# Altium schematic sheet Aixcel_Tiny_Recon_Board.SchDoc
size A4; Organization: Altium Limited; Address1: L3, 12a Rodborough Rd; Address2: Frenchs Forest; Address3: NSW; Address4: Australia 2086; DocumentNumber: 01; Revision: 01; SheetNumber: 1; SheetTotal: 4
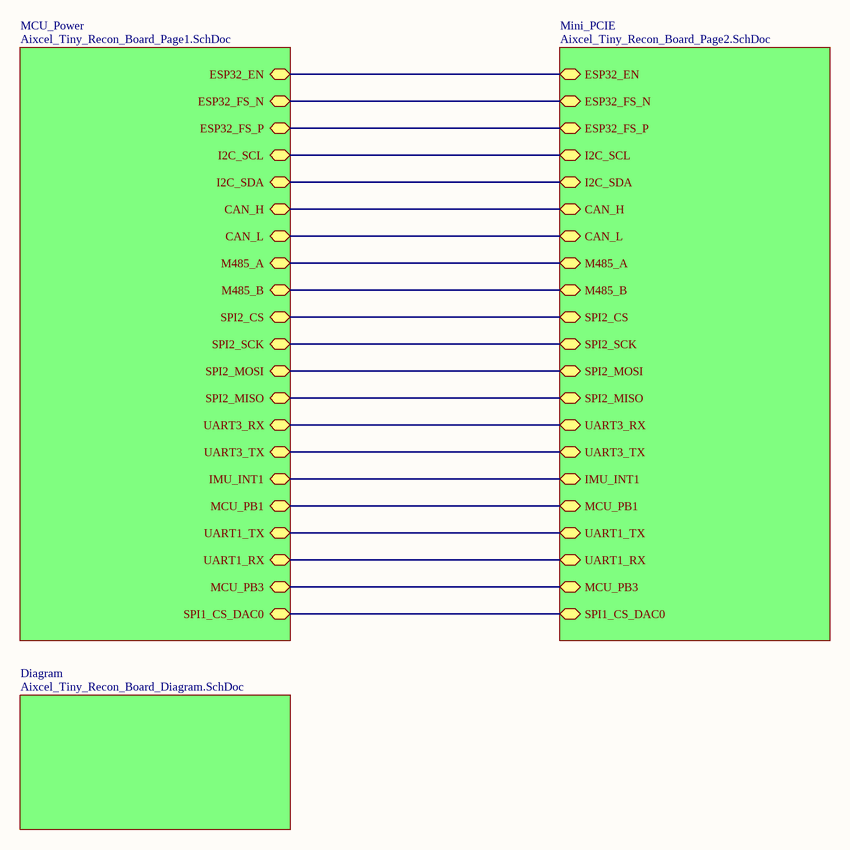
[diagram p0: Aixcel_Tiny_Recon_Board.SchDoc]

## Sub-sheets
Diagram = Aixcel_Tiny_Recon_Board_Diagram.SchDoc: no entries
MCU_Power = Aixcel_Tiny_Recon_Board_Page1.SchDoc: I2C_SCL (bidir), I2C_SDA (bidir), CAN_H (bidir), CAN_L (bidir), M485_A (bidir), M485_B (bidir), SPI2_CS (bidir), SPI2_SCK (bidir), SPI2_MOSI (bidir), SPI2_MISO (bidir), UART3_RX (bidir), UART3_TX (bidir), IMU_INT1 (bidir), MCU_PB1 (bidir), ESP32_FS_N (bidir), ESP32_FS_P (bidir), UART1_TX (bidir), UART1_RX (bidir), ESP32_EN (bidir), MCU_PB3 (bidir), SPI1_CS_DAC0 (bidir)
Mini_PCIE = Aixcel_Tiny_Recon_Board_Page2.SchDoc: I2C_SDA (bidir), I2C_SCL (bidir), CAN_H (bidir), CAN_L (bidir), M485_A (bidir), M485_B (bidir), SPI2_CS (bidir), SPI2_SCK (bidir), SPI2_MOSI (bidir), SPI2_MISO (bidir), UART3_RX (bidir), UART3_TX (bidir), IMU_INT1 (bidir), MCU_PB1 (bidir), ESP32_FS_P (bidir), ESP32_FS_N (bidir), UART1_TX (bidir), UART1_RX (bidir), ESP32_EN (bidir), MCU_PB3 (bidir), SPI1_CS_DAC0 (bidir)

## Nets
(unnamed): sheet MCU_Power/I2C_SCL, sheet Mini_PCIE/I2C_SCL
(unnamed): sheet MCU_Power/I2C_SDA, sheet Mini_PCIE/I2C_SDA
(unnamed): sheet MCU_Power/CAN_H, sheet Mini_PCIE/CAN_H
(unnamed): sheet MCU_Power/CAN_L, sheet Mini_PCIE/CAN_L
(unnamed): sheet MCU_Power/M485_A, sheet Mini_PCIE/M485_A
(unnamed): sheet MCU_Power/M485_B, sheet Mini_PCIE/M485_B
(unnamed): sheet MCU_Power/SPI2_CS, sheet Mini_PCIE/SPI2_CS
(unnamed): sheet MCU_Power/SPI2_SCK, sheet Mini_PCIE/SPI2_SCK
(unnamed): sheet MCU_Power/SPI2_MOSI, sheet Mini_PCIE/SPI2_MOSI
(unnamed): sheet MCU_Power/SPI2_MISO, sheet Mini_PCIE/SPI2_MISO
(unnamed): sheet MCU_Power/UART3_RX, sheet Mini_PCIE/UART3_RX
(unnamed): sheet MCU_Power/UART3_TX, sheet Mini_PCIE/UART3_TX
(unnamed): sheet MCU_Power/IMU_INT1, sheet Mini_PCIE/IMU_INT1
(unnamed): sheet MCU_Power/MCU_PB1, sheet Mini_PCIE/MCU_PB1
(unnamed): sheet MCU_Power/ESP32_FS_N, sheet Mini_PCIE/ESP32_FS_N
(unnamed): sheet MCU_Power/ESP32_FS_P, sheet Mini_PCIE/ESP32_FS_P
(unnamed): sheet MCU_Power/UART1_TX, sheet Mini_PCIE/UART1_TX
(unnamed): sheet MCU_Power/UART1_RX, sheet Mini_PCIE/UART1_RX
(unnamed): sheet MCU_Power/ESP32_EN, sheet Mini_PCIE/ESP32_EN
(unnamed): sheet MCU_Power/MCU_PB3, sheet Mini_PCIE/MCU_PB3
(unnamed): sheet MCU_Power/SPI1_CS_DAC0, sheet Mini_PCIE/SPI1_CS_DAC0

## Notes on the sheet
- Size:
- Model Name:
- A4
- Number:
- Revision:
- Aixcel Limited
- Guass Rd At Pudong
- ShangHai China +86
- Date:
- Time:
- Sheet
- of
- www.Aixcel.net <http://www.Aixcel.net>